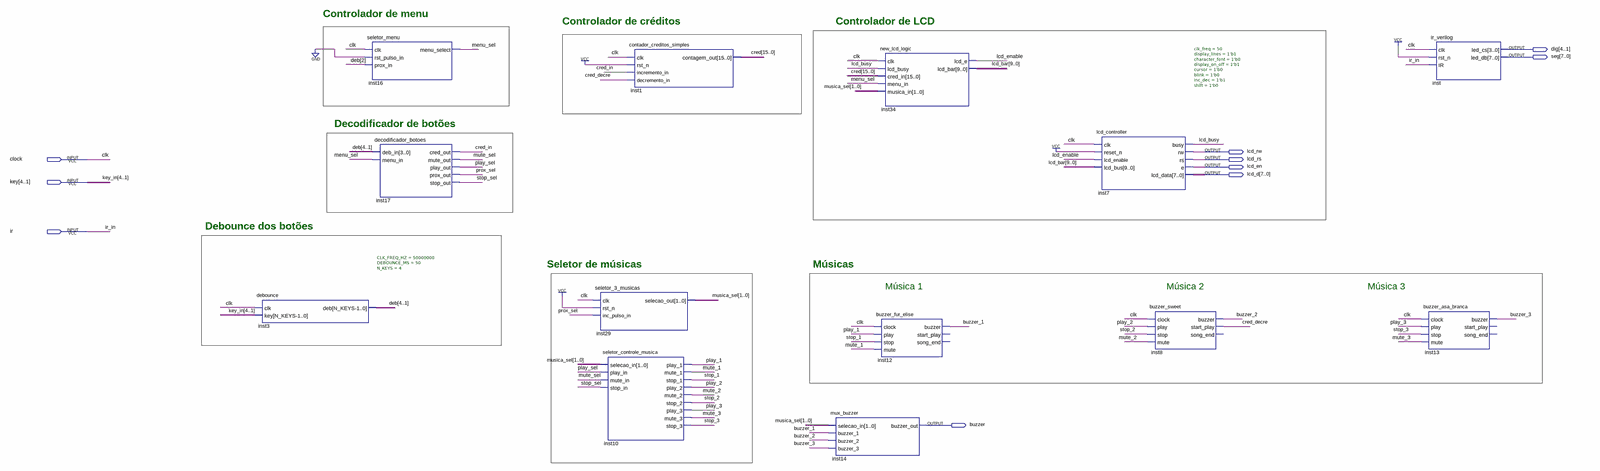
[diagram p0: schematic sheet, whole]
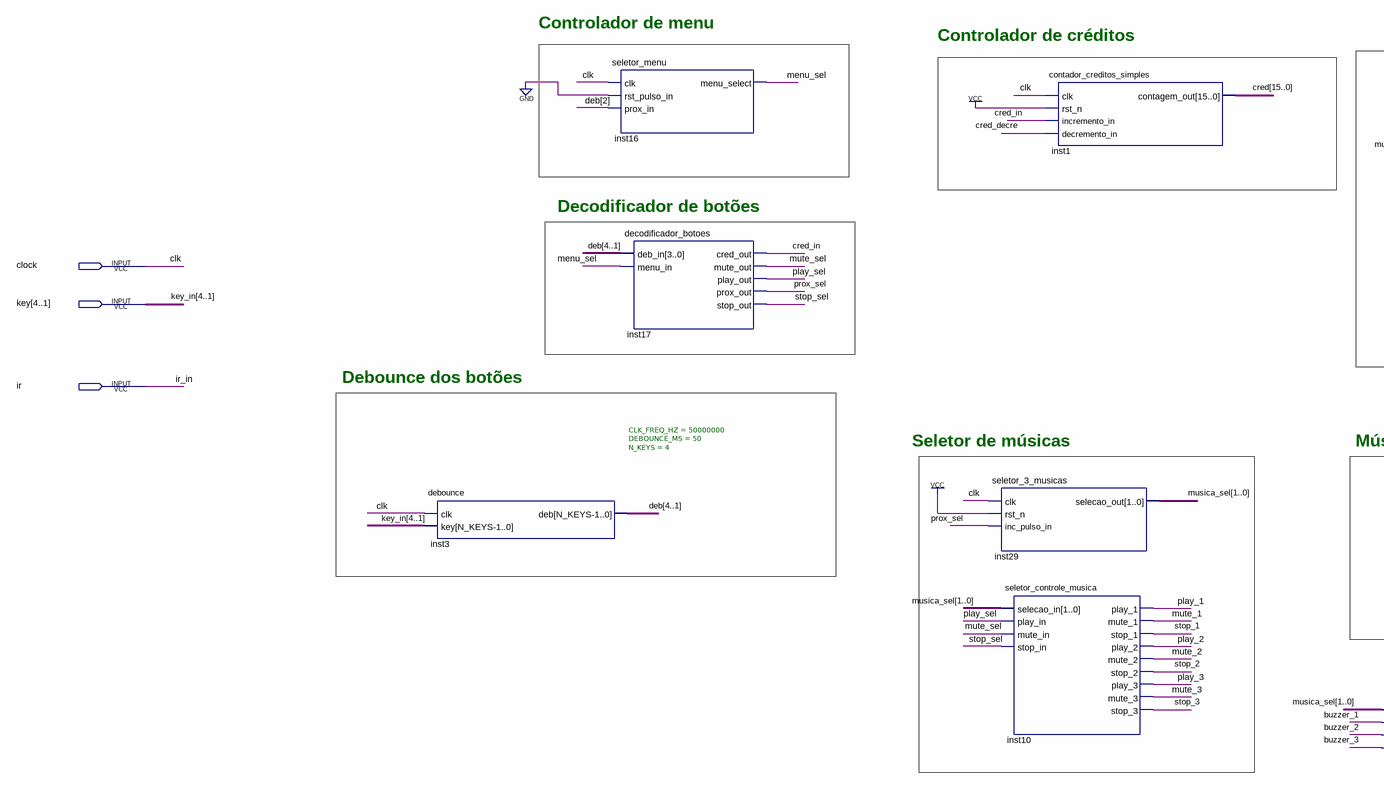
[diagram p1: schematic sheet, left part]
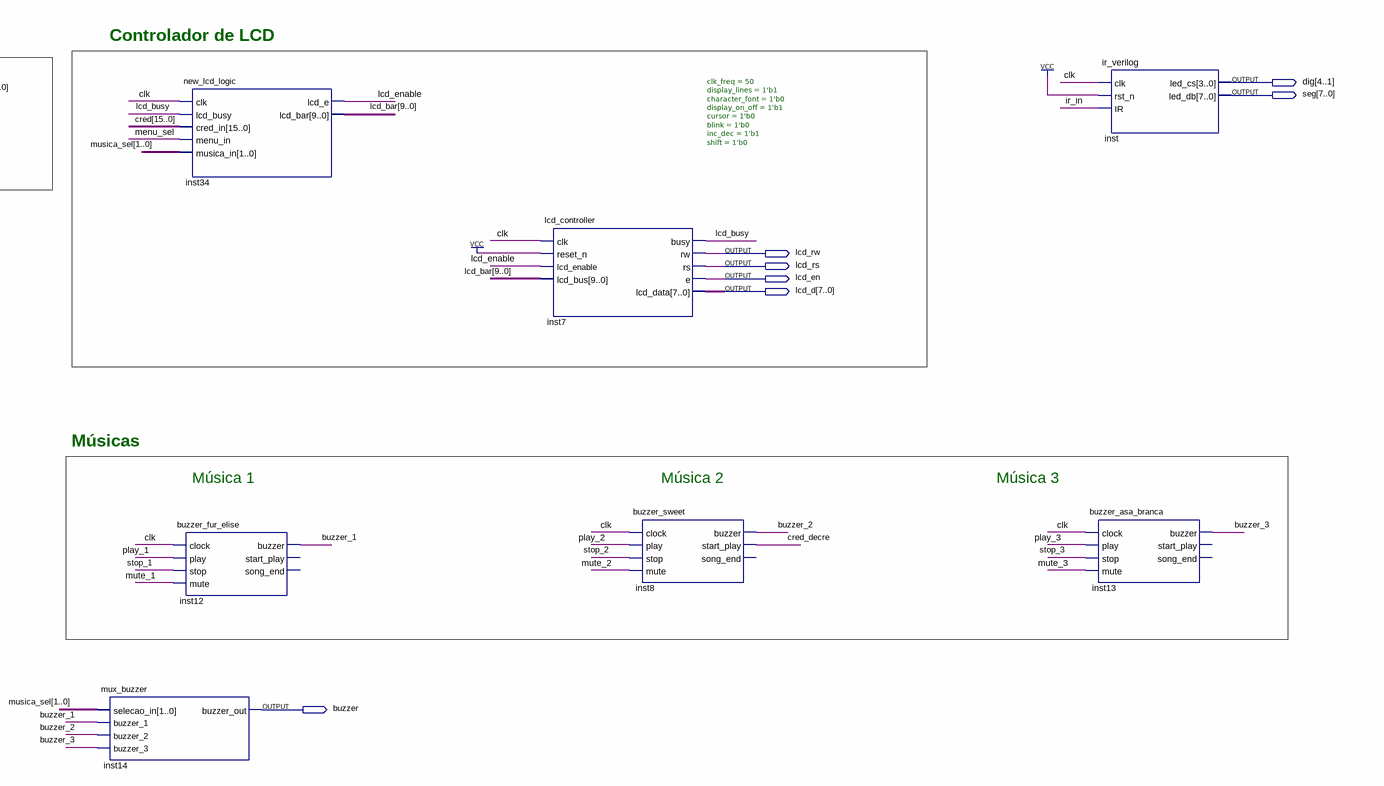
[diagram p2: schematic sheet, right part]
// Quartus schematic top_entity.bdf as structural Verilog: 13 symbols, 10 pins
module top_entity (
  input  clock,
  input  [4:1] key,
  input  ir,
  output [4:1] dig,
  output [7:0] seg,
  output lcd_rw,
  output lcd_rs,
  output lcd_en,
  output [7:0] lcd_d,
  output buzzer
);

  wire buzzer_1, buzzer_2, buzzer_3, cred_decre, cred_in, lcd_busy, lcd_enable, menu_sel, mute_1, mute_2,
       mute_3, mute_sel, play_1, play_2, play_3, play_sel, prox_sel, stop_1, stop_2, stop_3, stop_sel;
  wire [1:0] musica_sel;
  wire [4:1] deb;
  wire [9:0] lcd_bar;
  wire [15:0] cred;

  debounce #(.CLK_FREQ_HZ(50000000), .DEBOUNCE_MS(50), .N_KEYS(4)) inst3 (.clk(clock), .key(key), .deb(deb));
  seletor_menu inst16 (.clk(clock), .rst_pulso_in(1'b0), .prox_in(deb[2]), .menu_select(menu_sel));
  decodificador_botoes inst17 (
    .deb_in(deb), .menu_in(menu_sel), .cred_out(cred_in), .mute_out(mute_sel), .play_out(play_sel),
    .prox_out(prox_sel), .stop_out(stop_sel));
  seletor_3_musicas inst29 (.clk(clock), .rst_n(1'b1), .inc_pulso_in(prox_sel), .selecao_out(musica_sel));
  seletor_controle_musica inst10 (
    .selecao_in(musica_sel), .play_in(play_sel), .mute_in(mute_sel), .stop_in(stop_sel), .play_1(play_1),
    .mute_1(mute_1), .stop_1(stop_1), .play_2(play_2), .mute_2(mute_2), .stop_2(stop_2), .play_3(play_3),
    .mute_3(mute_3), .stop_3(stop_3));
  contador_creditos_simples inst1 (
    .clk(clock), .rst_n(1'b1), .incremento_in(cred_in), .decremento_in(cred_decre), .contagem_out(cred));
  mux_buzzer inst14 (
    .selecao_in(musica_sel), .buzzer_1(buzzer_1), .buzzer_2(buzzer_2), .buzzer_3(buzzer_3),
    .buzzer_out(buzzer));
  new_lcd_logic inst34 (
    .clk(clock), .lcd_busy(lcd_busy), .cred_in(cred), .menu_in(menu_sel), .musica_in(musica_sel),
    .lcd_e(lcd_enable), .lcd_bar(lcd_bar));
  buzzer_fur_elise inst12 (
    .clock(clock), .play(play_1), .stop(stop_1), .mute(mute_1), .buzzer(buzzer_1));  // open: start_play, song_end
  lcd_controller #(.clk_freq(50), .display_lines(1'b1), .character_font(1'b0), .display_on_off(1'b1), .cursor(1'b0), .blink(1'b0), .inc_dec(1'b1), .shift(1'b0)) inst7 (
    .clk(clock), .reset_n(1'b1), .lcd_enable(lcd_enable), .lcd_bus(lcd_bar), .busy(lcd_busy), .rw(lcd_rw),
    .rs(lcd_rs), .e(lcd_en), .lcd_data(lcd_d));
  buzzer_sweet inst8 (
    .clock(clock), .play(play_2), .stop(stop_2), .mute(mute_2), .buzzer(buzzer_2), .start_play(cred_decre));  // open: song_end
  ir_verilog inst (.clk(clock), .rst_n(1'b1), .IR(ir), .led_cs(dig), .led_db(seg));
  buzzer_asa_branca inst13 (
    .clock(clock), .play(play_3), .stop(stop_3), .mute(mute_3), .buzzer(buzzer_3));  // open: start_play, song_end

  // Other names for the same wires on the sheet: clk = clock; ir_in = ir; key_in[4:1] = key

  // Notes on the sheet:
  //   Controlador de menu
  //   Controlador de créditos
  //   Controlador de LCD
  //   Decodificador de botões
  //   Debounce dos botões
  //   Seletor de músicas
  //   Músicas
  //   Música 1
  //   Música 2
  //   Música 3
endmodule
